# EAGLE design midi_control (EAGLE 6.5.0)
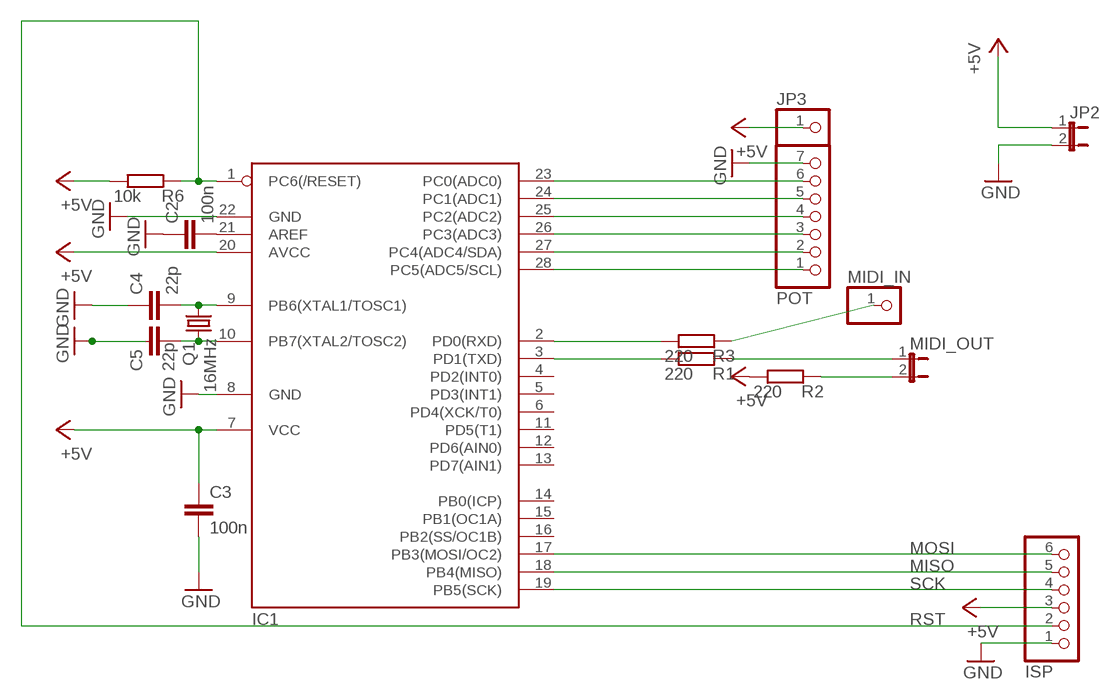
[diagram p0: schematic, sheet 1]

## Parts
C2  100n  C-EU025-024X044  [C025-024X044]
C3  100n  C-EU025-024X044  [C025-024X044]
C4  22p  C-EU025-024X044  [C025-024X044]
C5  22p  C-EU050-025X075  [C050-025X075]
IC1  MEGA8-P  [DIL28-3]
ISP  PINHD-1X6/90  [1X06/90]
JP2  JP1E  [JP1]
JP3  PINHD-1X1  [1X01]
MIDI_IN  PINHD-1X1  [1X01]
MIDI_OUT  JP1E  [JP1]
POT  PINHD-1X7  [1X07]
Q1  16MHz  CRYSTALTC26V  [TC26V]
R1  220  R-EU_0207/10  [0207/10]
R2  220  R-EU_R0805  [R0805]
R3  220  R-EU_0207/10  [0207/10]
R6  10k  R-EU_0207/15  [0207/15]

## Nets
+5V: C3.1 IC1.7(VCC) IC1.20(AVCC) ISP.3 JP2.1 JP3.1 R2.1 R6.1
GND: C2.1 C3.2 C4.1 C5.1 IC1.8(GND) IC1.22(GND) ISP.1 JP2.2 POT.7
MISO: IC1.18(PB4(MISO)) ISP.5
MOSI: IC1.17(PB3(MOSI/OC2)) ISP.6
N$1: C2.2 IC1.21(AREF)
N$2: IC1.2(PD0(RXD)) R3.1
N$3: IC1.3(PD1(TXD)) R1.1
N$4: MIDI_OUT.1 R1.2
N$5: MIDI_OUT.2 R2.2
N$6: IC1.23(PC0(ADC0)) POT.6
N$7: IC1.24(PC1(ADC1)) POT.5
N$8: IC1.25(PC2(ADC2)) POT.4
N$9: IC1.26(PC3(ADC3)) POT.3
N$10: IC1.27(PC4(ADC4/SDA)) POT.2
N$11: IC1.28(PC5(ADC5/SCL)) POT.1
N$13: MIDI_IN.1 R3.2
N$22: C4.2 IC1.9(PB6(XTAL1/TOSC1)) Q1.2
N$23: C5.2 IC1.10(PB7(XTAL2/TOSC2)) Q1.1
RST: IC1.1(PC6(/RESET)) ISP.2 R6.2
SCK: IC1.19(PB5(SCK)) ISP.4
Unconnected: IC1.4(PD2(INT0)) IC1.5(PD3(INT1)) IC1.6(PD4(XCK/T0)) IC1.11(PD5(T1)) IC1.12(PD6(AIN0)) IC1.13(PD7(AIN1)) IC1.14(PB0(ICP)) IC1.15(PB1(OC1A)) IC1.16(PB2(SS/OC1B))

## Library data of the parts
C2-C5 = rcl:C-EU: CAPACITOR, European symbol
IC1 = atmel:MEGA8-P: MICROCONTROLLER 8 Kbytes FLASH, 1 kbytes SRAM, 512 bytes EEPROM, USART, 4-channel 10 bit ADC, 2-channel 8 bit ADC Pin compatible with Atmega48, ATMega88, ATMega168 Source: avr.lbr
ISP = pinhead:PINHD-1X6: PIN HEADER
JP2 MIDI_OUT = jumper:JP1E: JUMPER
JP3 MIDI_IN = pinhead:PINHD-1X1: PIN HEADER
POT = pinhead:PINHD-1X7: PIN HEADER
Q1 = crystal:CRYSTAL: CRYSTAL
R1-R3 R6 = rcl:R-EU_: RESISTOR, European symbol

## Board
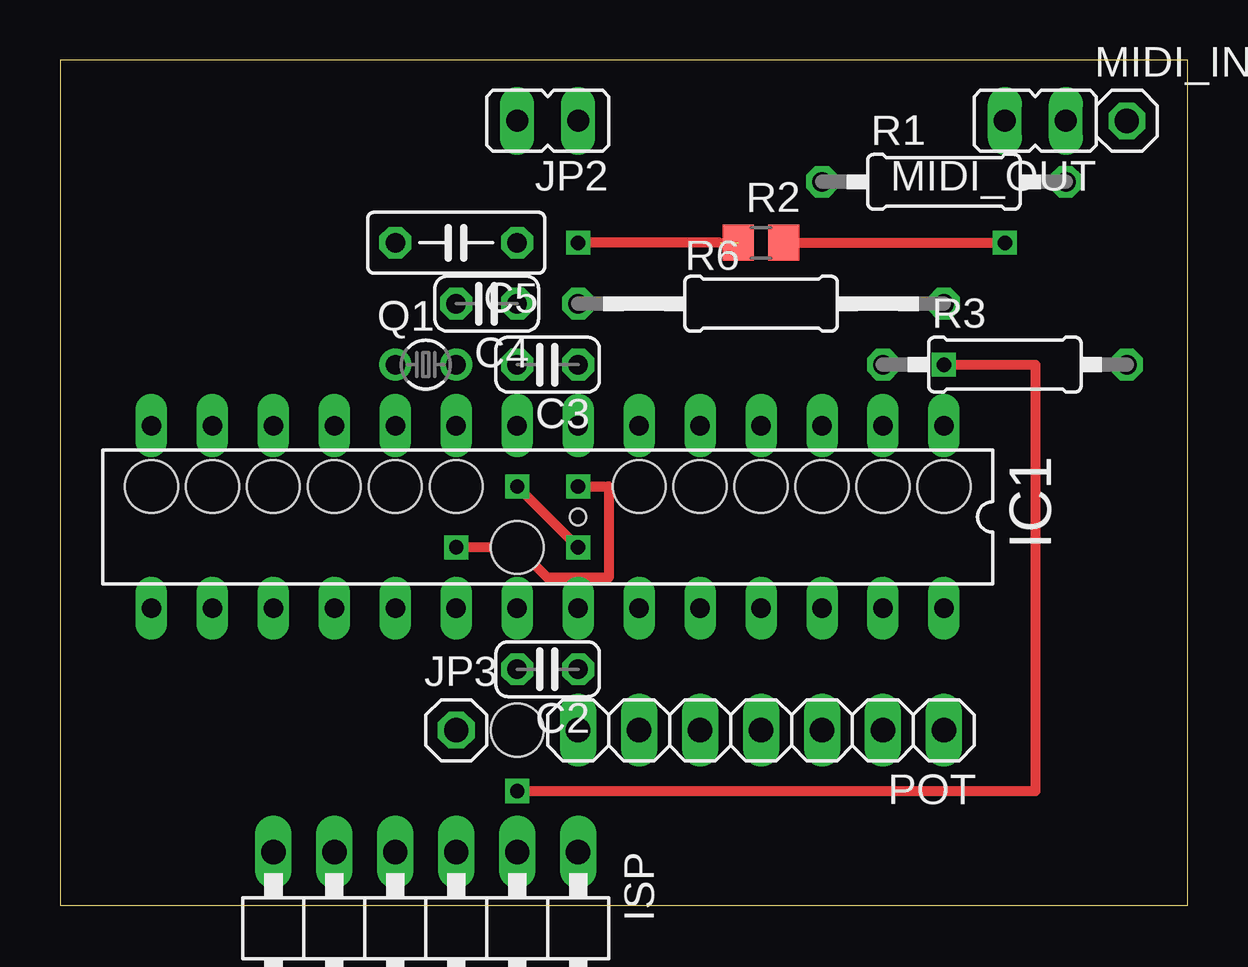
[diagram p1: board, top side]
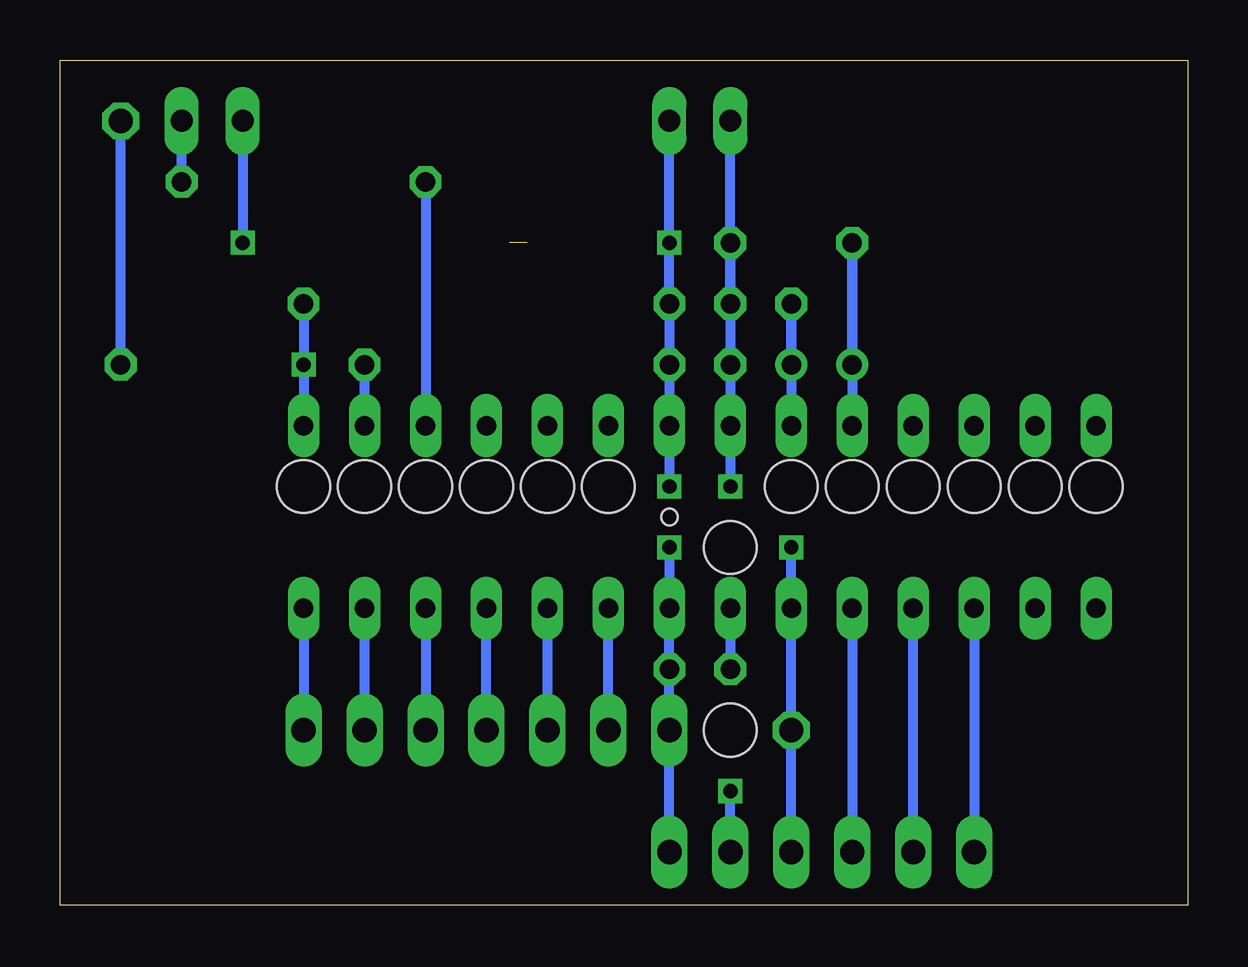
[diagram p2: board, bottom side, seen from below]

Size 46.98 x 35.23 mm. Coordinates in mm from the lower left corner, seen from the top.
Outline: 0,35.23 0,0 46.98,0 46.98,35.23 0,35.23
Copper layers (1*16): Top 0.035mm / dielectric 1.5mm / Bottom 0.035mm
Design rules "default": minimum track width 10mil, minimum drill 24mil, track to track 8mil, track to pad 8mil, pad to pad 8mil, via to via 8mil, smd to smd 8mil, copper to edge 40mil, drill to drill 8mil, minimum pad ring 10mil, minimum via ring 8mil, stop-mask expansion 4mil, vias tented up to drill 0mil, thermal gap 10mil
Holes 2.2 mm at 36.83,17.45 34.29,17.45 31.75,17.45 29.21,17.45 26.67,17.45 24.13,17.45 19.05,14.91 16.51,17.45 13.97,17.45 11.43,17.45 8.89,17.45 6.35,17.45 3.81,17.45 19.05,7.29
Holes 0.68 mm at 21.59,16.18

### Footprints (pad centres in the part's own frame; a part is rotated, then mirrored left to right if it is on the bottom)
C025-024X044 = drill 0.813 octagon: 1 -1.27,0; 2 1.27,0
C050-025X075 = drill 0.813 octagon: 1 -2.54,0; 2 2.54,0
DIL28-3 = drill 0.813 long: 1 -16.51,-3.81; 2 -13.97,-3.81; 3 -11.43,-3.81; 4 -8.89,-3.81; 5 -6.35,-3.81; 6 -3.81,-3.81; 7 -1.27,-3.81; 8 1.27,-3.81; 9 3.81,-3.81; 10 6.35,-3.81; 11 8.89,-3.81; 12 11.43,-3.81; 13 13.97,-3.81; 14 16.51,-3.81; 15 16.51,3.81; 16 13.97,3.81; 17 11.43,3.81; 18 8.89,3.81; 19 6.35,3.81; 20 3.81,3.81; 21 1.27,3.81; 22 -1.27,3.81; 23 -3.81,3.81; 24 -6.35,3.81; 25 -8.89,3.81; 26 -11.43,3.81; 27 -13.97,3.81; 28 -16.51,3.81
1X06/90 = drill 1.016 long: 1 -6.35,-3.81; 2 -3.81,-3.81; 3 -1.27,-3.81; 4 1.27,-3.81; 5 3.81,-3.81; 6 6.35,-3.81
JP1 = drill 0.914 long: 1 0,-1.27; 2 0,1.27
1X01 = drill 1.016 octagon: 1 0,0
1X07 = drill 1.016 long: 1 -7.62,0; 2 -5.08,0; 3 -2.54,0; 4 0,0; 5 2.54,0; 6 5.08,0; 7 7.62,0
TC26V = drill 0.813: 1 -1.27,0; 2 1.27,0
0207/10 = drill 0.813 octagon: 1 -5.08,0; 2 5.08,0
R0805 = smd 1.3 x 1.5: 1 -0.95,0; 2 0.95,0
0207/15 = drill 0.813 octagon: 1 -7.62,0; 2 7.62,0

### Placement (x,y rotation side)
C2  20.32,9.83 180 top
C3  20.32,22.53 180 top
C4  17.78,25.07 180 top
C5  16.51,27.61 180 top
IC1  20.32,16.18 180 top
ISP  15.24,-1.6 180 top
JP2  20.32,32.69 90 top
JP3  16.51,7.29 0 top
MIDI_IN  44.45,32.69 0 top
MIDI_OUT  40.64,32.69 90 top
POT  29.21,7.29 180 top
Q1  15.24,22.53 0 top
R1  36.83,30.15 0 top
R2  29.21,27.61 0 top
R3  39.37,22.53 0 top
R6  29.21,25.07 0 top

### Tracks (layer width: path | path; a pad name or v marks a point on that pad's centre or on a via)
+5V  (via drill 0.6)  (1 unrouted)
  Top 0.406: v21.59,17.45 22.86,17.45 22.86,13.64 20.32,13.64 19.05,14.91 v16.51,14.91 | 27.51,27.61 v21.59,27.61
  Bottom 0.406: v16.51,14.91 IC1.20 JP3.1 ISP.3 | v21.59,17.45 IC1.7 C3.1 R6.1 v21.59,27.61 JP2.1
GND  (via drill 0.6)
  Top 0.406: v19.05,17.45 v21.59,14.91
  Bottom 0.406: v21.59,14.91 IC1.22 C2.1 POT.7 ISP.1 | v19.05,17.45 IC1.8 C3.2 C5.1 | C4.1 C5.1 | C5.1 JP2.2
MISO
  Bottom 0.406: ISP.5 IC1.18
MOSI
  Bottom 0.406: IC1.17 ISP.6
N$1
  Bottom 0.406: IC1.21 C2.2
N$2
  Bottom 0.406: IC1.2 R3.1
N$3
  Bottom 0.406: R1.1 IC1.3
N$4
  Bottom 0.406: R1.2 MIDI_OUT.1
N$5  (via drill 0.6)
  Top 0.406: R2.2 v39.37,27.61
  Bottom 0.406: MIDI_OUT.2 v39.37,27.61
N$6
  Bottom 0.406: POT.6 IC1.23
N$7
  Bottom 0.406: IC1.24 POT.5
N$8
  Bottom 0.406: POT.4 IC1.25
N$9
  Bottom 0.406: IC1.26 POT.3
N$10
  Bottom 0.406: POT.2 IC1.27
N$11
  Bottom 0.406: IC1.28 POT.1
N$13
  Bottom 0.406: R3.2 MIDI_IN.1
N$22
  Bottom 0.406: Q1.2 C4.2 IC1.9
N$23
  Bottom 0.406: IC1.10 C5.2 Q1.1
RST  (via drill 0.6)
  Top 0.406: v36.83,22.53 40.64,22.53 40.64,4.75 v19.05,4.75
  Bottom 0.406: IC1.1 v36.83,22.53 R6.2 | ISP.2 v19.05,4.75
SCK
  Bottom 0.406: IC1.19 ISP.4

### Text on the board
Document: MOSI | MISO | SCK